# Altium schematic sheet connector.SchDoc: Connectors
size A3; Hw_rev: 0; License: GPLv3; Address3: Firenze; Address4: ITALY; DocumentNumber: 1; Revision: 0; SheetNumber: 1; SheetTotal: 8
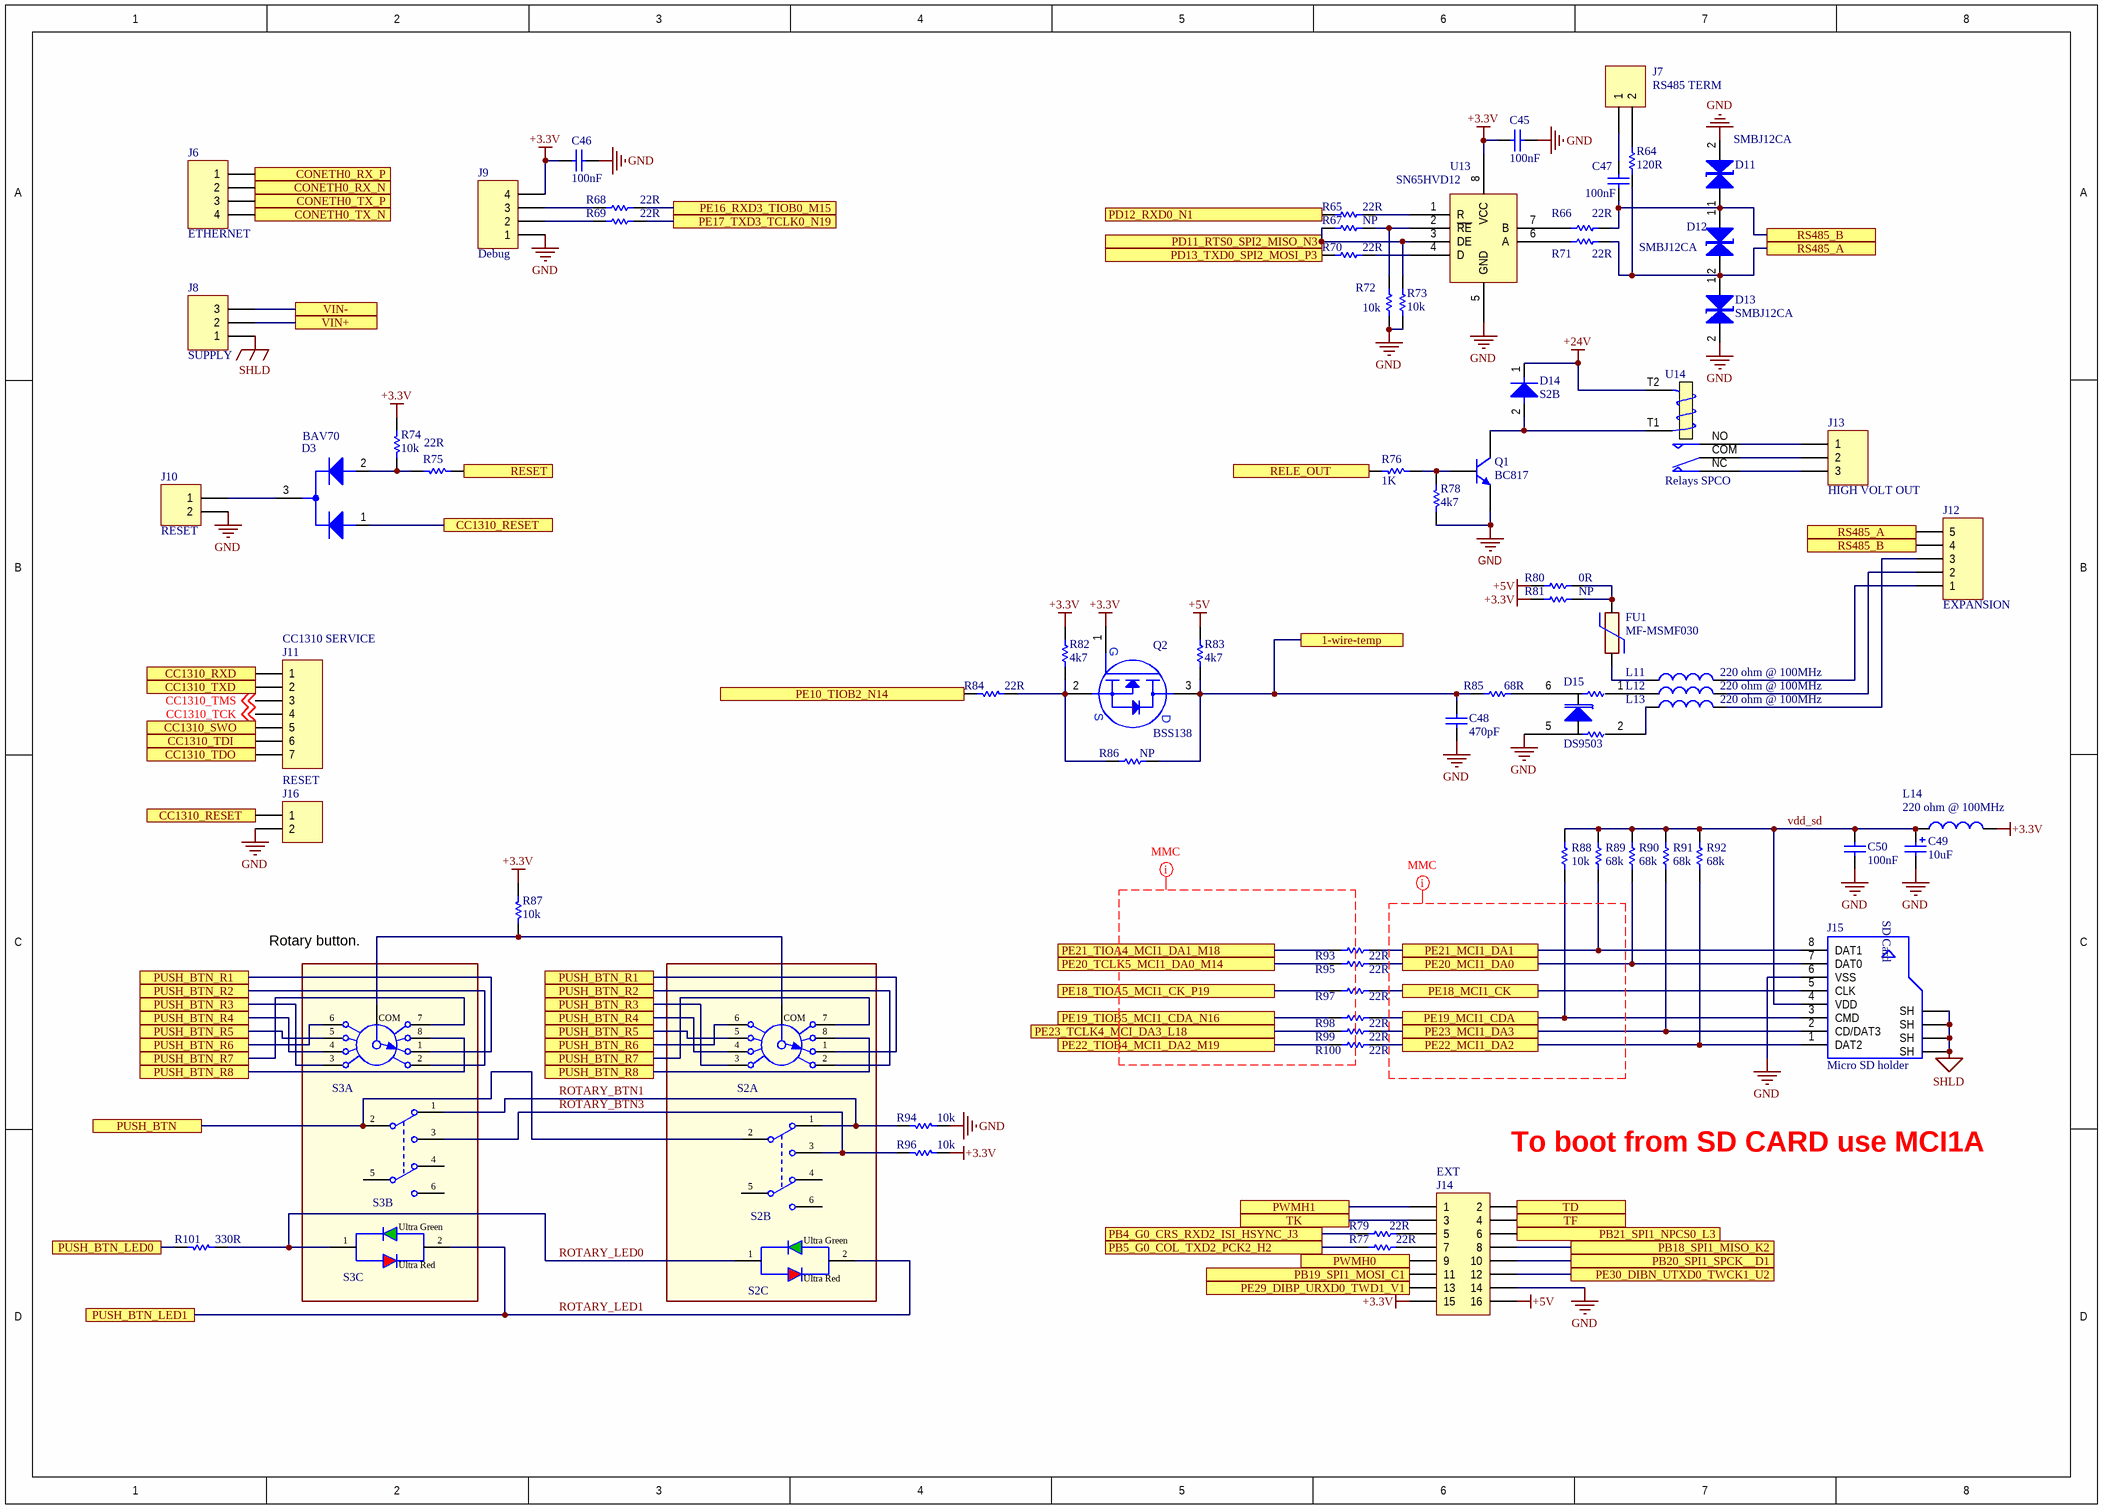
[diagram p0: connector.SchDoc]

## Parts
C45  100nF  [0603_[1608]]
C46  100nF  [0603_[1608]]
C47  100nF  [0603_[1608]]
C48  470pF  [0603_[1608]]
C49  10uF  [1206_[3216]]
C50  100nF  [0603_[1608]]
D3  BAV70  [SOT-23]
D11  SMBJ12CA  [DO214AA_K1-A2_SMB]
D12  SMBJ12CA  [DO214AA_K1-A2_SMB]
D13  SMBJ12CA  [DO214AA_K1-A2_SMB]
D14  S2B  [DO214AA_K1-A2_SMB]
D15  DS9503  [TSOC6]
FU1  MF-MSMF030  [1812-[4532]]
J6  ETHERNET  [CON_4P_WAGO_2.5MM]
J7  RS485 TERM  [HEADER_1X2_2.54MM_THD]
J8  SUPPLY  [CON_3P_WAGO_3.5mm]
J9  Debug  [HEADER_1X4_2.54MM_THD]
J10  RESET  [HEADER_1X2_2.54MM_THD]
J11  CC1310 SERVICE  [HEADER_1X7_2.54MM_THD]
J12  EXPANSION  [CON_5P_WAGO_2.5MM]
J13  HIGH VOLT OUT  [CON_3P_WAGO_3.5mm]
J14  EXT  [HEADER_2X8_2.54MM_THD]
J15  Micro SD holder  [micro_sd_holder_pp]
J16  RESET  [HEADER_1X2_2.54MM_THD]
L11  220 ohm @ 100MHz  [0805_[2012]]
L12  220 ohm @ 100MHz  [0805_[2012]]
L13  220 ohm @ 100MHz  [0805_[2012]]
L14  220 ohm @ 100MHz  [0805_[2012]]
Q1  BC817  [SOT-23]
Q2  BSS138  [sot-23]
R64  120R  [0603_[1608]]
R65  22R  [0603_[1608]]
R66  22R  [0603_[1608]]
R67  NP  [0603_[1608]]
R68  22R  [0603_[1608]]
R69  22R  [0603_[1608]]
R70  22R  [0603_[1608]]
R71  22R  [0603_[1608]]
R72  10k  [0603_[1608]]
R73  10k  [0603_[1608]]
R74  10k  [0603_[1608]]
R75  22R  [0603_[1608]]
R76  1K  [0603_[1608]]
R77  22R  [0603_[1608]]
R78  4k7  [0603_[1608]]
R79  22R  [0603_[1608]]
R80  0R  [0603_[1608]]
R81  NP  [0603_[1608]]
R82  4k7  [0603_[1608]]
R83  4k7  [0603_[1608]]
R84  22R  [0603_[1608]]
R85  68R  [0603_[1608]]
R86  NP  [0603_[1608]]
R87  10k  [0603_[1608]]
R88  10k  [0603_[1608]]
R89  68k  [0603_[1608]]
R90  68k  [0603_[1608]]
R91  68k  [0603_[1608]]
R92  68k  [0603_[1608]]
R93  22R  [0603_[1608]]
R94  10k  [0603_[1608]]
R95  22R  [0603_[1608]]
R96  10k  [0603_[1608]]
R97  22R  [0603_[1608]]
R98  22R  [0603_[1608]]
R99  22R  [0603_[1608]]
R100  22R  [0603_[1608]]
R101  330R  [0603_[1608]]
S2  481RV12172100  [Rotary-push-button-481RV12172100]  (value not drawn)  (parts A,B,C of 3)
S3  481RV12172100  [Rotary-push-button-481RV12172100]  (value not drawn)  (parts A,B,C of 3)
U13  SN65HVD12  [SOIC8]
U14  Relays SPCO  [RELAYS_SPDT_THD_20x10MM]

## Ports
1-wire-temp, CC1310_RESET, CC1310_RXD, CC1310_SWO, CC1310_TDI, CC1310_TDO, CC1310_TXD, CONETH0_RX_N, CONETH0_RX_P, CONETH0_TX_N, CONETH0_TX_P, PB4_G0_CRS_RXD2_ISI_HSYNC_J3, PB5_G0_COL_TXD2_PCK2_H2, PB18_SPI1_MISO_K2, PB19_SPI1_MOSI_C1, PB20_SPI1_SPCK__D1, PB21_SPI1_NPCS0_L3, PD11_RTS0_SPI2_MISO_N3, PD12_RXD0_N1, PD13_TXD0_SPI2_MOSI_P3, PE10_TIOB2_N14, PE16_RXD3_TIOB0_M15, PE17_TXD3_TCLK0_N19, PE18_MCI1_CK, PE18_TIOA5_MCI1_CK_P19, PE19_MCI1_CDA, PE19_TIOB5_MCI1_CDA_N16, PE20_MCI1_DA0, PE20_TCLK5_MCI1_DA0_M14, PE21_MCI1_DA1, PE21_TIOA4_MCI1_DA1_M18, PE22_MCI1_DA2, PE22_TIOB4_MCI1_DA2_M19, PE23_MCI1_DA3, PE23_TCLK4_MCI_DA3_L18, PE29_DIBP_URXD0_TWD1_V1, PE30_DIBN_UTXD0_TWCK1_U2, PUSH_BTN, PUSH_BTN_LED0, PUSH_BTN_LED1, PUSH_BTN_R1, PUSH_BTN_R2, PUSH_BTN_R3, PUSH_BTN_R4, PUSH_BTN_R5, PUSH_BTN_R6, PUSH_BTN_R7, PUSH_BTN_R8, PWMH0, PWMH1, RELE_OUT, RESET, RS485_A, RS485_B, TD, TF, TK, VIN+, VIN-

## Nets
+3.3V: C45.2 C46.1 J9.4 J14.15 L14.1 Q2.1(G) R74.1 R81.2 R82.2 R87.1 R96.1 U13.8(VCC)
+5V: J14.16 R80.2 R83.2
+24V: D14.1(K) U14.T2
GND: C45.1 C46.2 C48.2 C49.2 C50.2 D11.2 D13.2 D15.5 J9.1 J10.2 J14.14 J15.6(VSS) J16.2 Q1.2(E) R72.1 R73.1 R78.1 R94.1 U13.5(GND)
SHLD: J8.1 J15.Z1(SH) J15.Z2(SH) J15.Z3(SH) J15.Z4(SH)
1-wire-temp: C48.1 Q2.3(D) R83.1 R85.1 R86.2 ; port 1-wire-temp
CC1310_RESET: D3.1 J16.1 ; port CC1310_RESET
CC1310_RXD: J11.1 ; port CC1310_RXD
CC1310_SWO: J11.5 ; port CC1310_SWO
CC1310_TCK: J11.4 ; off-sheet CC1310_TCK
CC1310_TDI: J11.6 ; port CC1310_TDI
CC1310_TDO: J11.7 ; port CC1310_TDO
CC1310_TMS: J11.3 ; off-sheet CC1310_TMS
CC1310_TXD: J11.2 ; port CC1310_TXD
CONETH0_RX_N: J6.2 ; port CONETH0_RX_N
CONETH0_RX_P: J6.1 ; port CONETH0_RX_P
CONETH0_TX_N: J6.4 ; port CONETH0_TX_N
CONETH0_TX_P: J6.3 ; port CONETH0_TX_P
PB4_G0_CRS_RXD2_ISI_HSYNC_J3: R79.1 ; port PB4_G0_CRS_RXD2_ISI_HSYNC_J3
PB5_G0_COL_TXD2_PCK2_H2: R77.1 ; port PB5_G0_COL_TXD2_PCK2_H2
PB18_SPI1_MISO_K2: J14.8 ; port PB18_SPI1_MISO_K2
PB19_SPI1_MOSI_C1: J14.11 ; port PB19_SPI1_MOSI_C1
PB20_SPI1_SPCK__D1: J14.10 ; port PB20_SPI1_SPCK__D1
PB21_SPI1_NPCS0_L3: J14.6 ; port PB21_SPI1_NPCS0_L3
PD11_RTS0_SPI2_MISO_N3: R67.2 R73.2 U13.3(DE) ; port PD11_RTS0_SPI2_MISO_N3
PD12_RXD0_N1: R65.2 ; port PD12_RXD0_N1
PD13_TXD0_SPI2_MOSI_P3: R70.2 ; port PD13_TXD0_SPI2_MOSI_P3
PE10_TIOB2_N14: R84.2 ; port PE10_TIOB2_N14
PE16_RXD3_TIOB0_M15: R68.1 ; port PE16_RXD3_TIOB0_M15
PE17_TXD3_TCLK0_N19: R69.1 ; port PE17_TXD3_TCLK0_N19
PE18_MCI1_CK: J15.5(CLK) R97.2 ; port PE18_MCI1_CK
PE18_TIOA5_MCI1_CK_P19: R97.1 ; port PE18_TIOA5_MCI1_CK_P19
PE19_MCI1_CDA: J15.3(CMD) R88.2 R98.2 ; port PE19_MCI1_CDA
PE19_TIOB5_MCI1_CDA_N16: R98.1 ; port PE19_TIOB5_MCI1_CDA_N16
PE20_MCI1_DA0: J15.7(DAT0) R90.2 R95.2 ; port PE20_MCI1_DA0
PE20_TCLK5_MCI1_DA0_M14: R95.1 ; port PE20_TCLK5_MCI1_DA0_M14
PE21_MCI1_DA1: J15.8(DAT1) R89.2 R93.2 ; port PE21_MCI1_DA1
PE21_TIOA4_MCI1_DA1_M18: R93.1 ; port PE21_TIOA4_MCI1_DA1_M18
PE22_MCI1_DA2: J15.1(DAT2) R92.2 R100.2 ; port PE22_MCI1_DA2
PE22_TIOB4_MCI1_DA2_M19: R100.1 ; port PE22_TIOB4_MCI1_DA2_M19
PE23_MCI1_DA3: J15.2(CD/DAT3) R91.2 R99.2 ; port PE23_MCI1_DA3
PE23_TCLK4_MCI_DA3_L18: R99.1 ; port PE23_TCLK4_MCI_DA3_L18
PE29_DIBP_URXD0_TWD1_V1: J14.13 ; port PE29_DIBP_URXD0_TWD1_V1
PE30_DIBN_UTXD0_TWCK1_U2: J14.12 ; port PE30_DIBN_UTXD0_TWCK1_U2
PUSH_BTN: S2.P2 S3.P2 ; port PUSH_BTN
PUSH_BTN_LED0: R101.2 ; port PUSH_BTN_LED0
PUSH_BTN_R1: S2.R1 S3.R1 ; port PUSH_BTN_R1
PUSH_BTN_R2: S2.R2 S3.R2 ; port PUSH_BTN_R2
PUSH_BTN_R3: S2.R3 S3.R3 ; port PUSH_BTN_R3
PUSH_BTN_R4: S2.R4 S3.R4 ; port PUSH_BTN_R4
PUSH_BTN_R5: S2.R5 S3.R5 ; port PUSH_BTN_R5
PUSH_BTN_R6: S2.R6 S3.R6 ; port PUSH_BTN_R6
PUSH_BTN_R7: S2.R7 S3.R7 ; port PUSH_BTN_R7
PUSH_BTN_R8: S2.R8 S3.R8 ; port PUSH_BTN_R8
PWMH0: J14.9 ; port PWMH0
PWMH1: J14.1 ; port PWMH1
RELE_OUT: R76.2 ; port RELE_OUT
RESET: R75.2 ; port RESET
ROTARY_BTN1: R94.2 S2.P1 S3.P1
ROTARY_BTN3: R96.2 S2.P3 S3.P3
ROTARY_LED0: R101.1 S2.L1 S3.L1
ROTARY_LED1: S2.L2 S3.L2 ; port PUSH_BTN_LED1
RS485_A: D12.2 D13.1 J12.5 R64.2 R71.2 ; port RS485_A
RS485_B: C47.2 D11.1 D12.1 J12.4 R66.2 ; port RS485_B
TD: J14.2 ; port TD
TF: J14.4 ; port TF
TK: J14.3 ; port TK
vdd_sd: C49.1 C50.1 J15.4(VDD) L14.2 R88.1 R89.1 R90.1 R91.1 R92.1
VIN+: J8.2 ; port VIN+
VIN-: J8.3 ; port VIN-
NetC47_1: C47.1 J7.1
NetD3_2: D3.2 R74.2 R75.1
NetD3_3: D3.3 J10.1
NetD14_2: D14.2(A) Q1.3(C) U14.T1
NetD15_1: D15.1 L12.1
NetD15_2: D15.2 L13.1
NetD15_6: D15.6 R85.2
NetFU1_1: FU1.1 R80.1 R81.1
NetFU1_2: FU1.2 L11.1
NetJ7_2: J7.2 R64.1
NetJ9_2: J9.2 R69.2
NetJ9_3: J9.3 R68.2
NetJ12_1: J12.1 L11.2
NetJ12_2: J12.2 L12.2
NetJ12_3: J12.3 L13.2
NetJ13_1: J13.1 U14.NO
NetJ13_2: J13.2 U14.COM
NetJ13_3: J13.3 U14.NC
NetJ14_5: J14.5 R79.2
NetJ14_7: J14.7 R77.2
NetQ1_1: Q1.1(B) R76.1 R78.2
NetQ2_2: Q2.2(S) R82.1 R84.1 R86.1
NetR65_1: R65.1 U13.1(R)
NetR66_1: R66.1 U13.7(B)
NetR67_1: R67.1 R72.2 U13.2(~{RE})
NetR70_1: R70.1 U13.4(D)
NetR71_1: R71.1 U13.6(A)
NetR87_2: R87.2 S2.C S3.C

Not connected (* = marked no-connect by the designer): S2 P4 P5 P6; S3 P4 P5 P6

## Layout directives
net class mmc: (no net found under the mark)
net class mmc_con: (no net found under the mark)

## Notes on the sheet
- Rotary button.
- To boot from SD CARD use MCI1A
- (in symbol micro_sd_holde) SD Card
- (in symbol Rotary-push-button-481RV12172100, part A) 6; COM; 7; 5; 8; 4; 1; 3; 2
- (in symbol Rotary-push-button-481RV12172100, part B) 1; 2; 3; 4; 5; 6
- (in symbol Rotary-push-button-481RV12172100, part C) Ultra Green; 1; 2; Ultra Red

## Library data of the parts
C45 C47 C48 C50 = Cap: Ceramic X7R 50V; Value: 100pF; Published: 8-Jun-2000; LatestRevisionDate: 17-Jul-2002; LatestRevisionNote: Re-released for DXP Platform.; PackageReference: RAD-0.3; Publisher: Altium Limited; PackageDescription: Radial Cap, Thru-Hole; 2 Leads; 0.3 in Pin Spacing
C46 = Cap: Ceramic X7R 50V; Value: 10nF; Published: 8-Jun-2000; Revision: July-2002: Re-released for DXP Platform.; Publisher: Altium Limited
C49 = Cap Pol1: Ceramic X5R 25V; Published: 8-Jun-2000; Revision: July-2002: Re-released for DXP Platform.; Publisher: Altium Limited; Value: 10uF
D3 = BAV70: SOT23
D11-D13 = TVS bi: TVS bidirectional
D14 = Diode: S2B Diode
D15 = DS9503: ESD Protection Diode with Resistors; Mouser: 700-DS9503P+T&R; Farnell: 2516827
FU1 = FuseAutoReset: Fuse autoreset; Farnell: 1652168; Mouser: 652-MF-MSMF030-2
J6 = Header 4: Header, 4-Pin; LatestRevisionDate: 17-Jul-2002; LatestRevisionNote: Re-released for DXP Platform.; Publisher: Altium Limited
J7 = Header 2: Pin Header, 2.54mm, 1x2, 2pin; LatestRevisionDate: 17-Jul-2002; LatestRevisionNote: Re-released for DXP Platform.; Publisher: Altium Limited
J8 J13 = Header 3: Terminal Block, 3.5mm, 3p, screew less; LatestRevisionDate: 17-Jul-2002; LatestRevisionNote: Re-released for DXP Platform.; Publisher: Altium Limited
J9 = Header 4: Pin Header, 4pin, 4x1, 2.54mm, THD; LatestRevisionDate: 17-Jul-2002; LatestRevisionNote: Re-released for DXP Platform.; Publisher: Altium Limited
J10 J16 = Header 2: Pin Header, 2pin, 1x2, 2.54mm, THD; LatestRevisionDate: 17-Jul-2002; LatestRevisionNote: Re-released for DXP Platform.; Publisher: Altium Limited
J11 = Header 7: Header, 7-Pin; LatestRevisionDate: 17-Jul-2002; LatestRevisionNote: Re-released for DXP Platform.; Publisher: Altium Limited
J12 = Header 5: Terminal Block, 2.5mm, 5p (Wago 250-405); LatestRevisionDate: 17-Jul-2002; LatestRevisionNote: Re-released for DXP Platform.; Publisher: Altium Limited
J14 = Header 8X2: Header, 8-Pin, Dual row; LatestRevisionDate: 17-Jul-2002; LatestRevisionNote: Re-released for DXP Platform.; Publisher: Altium Limited
J15 = micro_sd_holde: WR-CRD Micro SD_Push and Push (693071010811); Manufacturer: Würth Elektronik eiSos GmbH; ComponentLink1 Description: Manufacturer; ComponentLink2 Description: Datasheet; NoPins: 8; ComponentLink1URL: http://www.we-online.de; ComponentLink2URL: http://katalog.we-online.de/em/datasheet/693071010811.pdf; Created by: Karrer Zheng; Created Date: 10/10/2014; partNo: 693071010811
L11-L13 = Inductor: WE 742792022; Code_IEC: 1005; Value: 10mH; Published: 8-Jun-2000; LatestRevisionDate: 29-May-2009; LatestRevisionNote: IPC-7351 Footprint Added.; PackageReference: 0402-A; Publisher: Altium Limited; PackageDescription: Chip Inductor; Code_JEITA: 0402
L14 = Inductor: WE 742792022
Q1 = BC817: NPN General-purpose Transistor; Published: 17-Sep-2003; LatestRevisionDate: 12-Dec-2006; LatestRevisionNote: IPC-7351 Footprint Added.; DatasheetVersion: Jun-1999; PackageVersion: May-1999; PackageReference: SOT23; Publisher: Altium Limited; PackageDescription: 3-Pin SOT-23 Package 0.95 mm Pitch, 2.3 mm Lead Span; ComponentLink1Description: Manufacturer Link; ComponentLink1URL: http://www.semiconductors.philips.com/; ComponentLink2Description: Datasheet; ComponentLink2URL: http://www.semiconductors.philips.com/acrobat/datasheets/BC817_BC817W_BC337_5.pdf
Q2 = MOSFET-N 3pin: N MOS
R64 R66 R67 R71-R73 R76-R79 R82-R87 R94 R96 R101 = Res1: Resistor; Revision: July-2002: Re-released for DXP Platform.
R65 R68-R70 R74 R75 R80 R81 R88-R93 R95 R97-R100 = Res1: Resistor; Value: 1K; Published: 8-Jun-2000; Revision: July-2002: Re-released for DXP Platform.; Publisher: Altium Limited
S2 S3 = Rotary-push-button-481RV12172100: WS-RPTL 20x20 mm illuminated THT Rotary Push button Switch; Emitting Color: Red & Bright green; ComponentLink1Description: Manufacturer; ComponentLink1URL: http://www.we-online.de; ComponentLink2Description: Datasheet; ComponentLink2URL: http://katalog.we-online.de/em/datasheet/481RV12172100.pdf; Part Number: 481RV12172100; Published Date: June 2017; Publisher: Wurth Elektronik
U13 = SN65HVD12: 3.3V to RS485 interface
U14 = Relay SPCO: Relays SPCO, Coil 12V, 250Vac (Omron G5SB); Farnell: 2213814